# Altium schematic sheet brew_schematic.SchDoc: Monk
size A
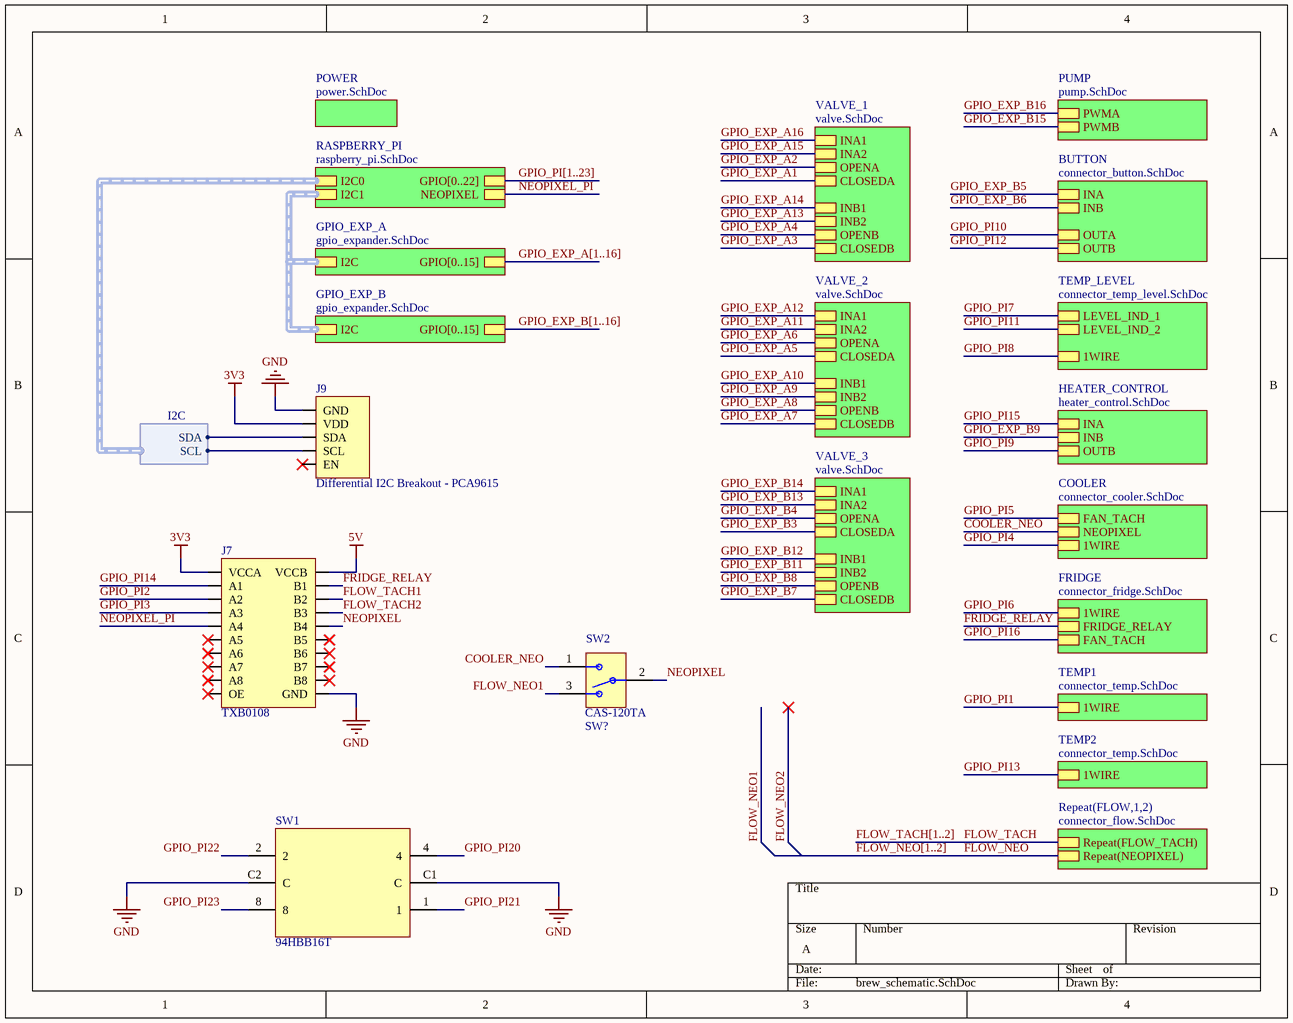
[diagram p0: brew_schematic.SchDoc]

## Parts
J7  TXB0108  [TXB0108]
J9  Differential I2C Breakout - PCA9615  [Differential I2C Breakout - PCA9615]
SW1  MFG P/N: 94HBB16T  [SW_HEX_ROTARY_94HBB16T]  (hidden comment: SWITCH_HEX ROTARY_50V_DIP16)
SW2  MFG P/N: CAS-120TA  Designator: SW?  [SWITCH_CAS-120TA]  (hidden comment: SWITCH_DIP_SPDT_CAS-120TA)

## Sub-sheets
BUTTON = connector_button.SchDoc: INA, INB, OUTB, OUTA
COOLER = connector_cooler.SchDoc: NEOPIXEL, FAN_TACH, 1WIRE
FRIDGE = connector_fridge.SchDoc: FRIDGE_RELAY, 1WIRE, FAN_TACH
GPIO_EXP_A = gpio_expander.SchDoc: GPIO[0..15], I2C (harness I2C)
GPIO_EXP_B = gpio_expander.SchDoc: GPIO[0..15], I2C (harness I2C)
HEATER_CONTROL = heater_control.SchDoc: INA, INB, OUTB
POWER = power.SchDoc: no entries
PUMP = pump.SchDoc: PWMB, PWMA
RASPBERRY_PI = raspberry_pi.SchDoc: I2C1 (harness I2C), I2C0 (harness I2C), GPIO[0..22], NEOPIXEL
Repeat(FLOW,1,2) = connector_flow.SchDoc: Repeat(FLOW_TACH), Repeat(NEOPIXEL)
TEMP1 = connector_temp.SchDoc: 1WIRE
TEMP2 = connector_temp.SchDoc: 1WIRE
TEMP_LEVEL = connector_temp_level.SchDoc: 1WIRE, LEVEL_IND_2, LEVEL_IND_1
VALVE_1 = valve.SchDoc: CLOSEDB, INA2, OPENB, OPENA, CLOSEDA, INB2, INB1, INA1
VALVE_2 = valve.SchDoc: CLOSEDB, INA2, OPENB, OPENA, CLOSEDA, INB2, INB1, INA1
VALVE_3 = valve.SchDoc: CLOSEDB, INA2, OPENB, OPENA, CLOSEDA, INB2, INB1, INA1

## Harnesses
I2C: SDA, SCL

## Nets
3V3: J7.1(VCCA) J9.2(VDD)
5V: J7.20(VCCB)
GND: J7.11(GND) J9.1(GND) SW1.C1(C) SW1.C2(C)
COOLER_NEO: SW2.1 ; sheet COOLER/NEOPIXEL
FLOW_NEO: sheet Repeat(FLOW,1,2)/Repeat(NEOPIXEL)
FLOW_NEO1: SW2.3
FLOW_TACH: sheet Repeat(FLOW,1,2)/Repeat(FLOW_TACH)
FLOW_TACH1: J7.18(B2)
FLOW_TACH2: J7.17(B3)
FRIDGE_RELAY: J7.19(B1) ; sheet FRIDGE/FRIDGE_RELAY
GPIO_EXP_A1: sheet VALVE_1/CLOSEDA
GPIO_EXP_A2: sheet VALVE_1/OPENA
GPIO_EXP_A3: sheet VALVE_1/CLOSEDB
GPIO_EXP_A4: sheet VALVE_1/OPENB
GPIO_EXP_A5: sheet VALVE_2/CLOSEDA
GPIO_EXP_A6: sheet VALVE_2/OPENA
GPIO_EXP_A7: sheet VALVE_2/CLOSEDB
GPIO_EXP_A8: sheet VALVE_2/OPENB
GPIO_EXP_A9: sheet VALVE_2/INB2
GPIO_EXP_A10: sheet VALVE_2/INB1
GPIO_EXP_A11: sheet VALVE_2/INA2
GPIO_EXP_A12: sheet VALVE_2/INA1
GPIO_EXP_A13: sheet VALVE_1/INB2
GPIO_EXP_A14: sheet VALVE_1/INB1
GPIO_EXP_A15: sheet VALVE_1/INA2
GPIO_EXP_A16: sheet VALVE_1/INA1
GPIO_EXP_B3: sheet VALVE_3/CLOSEDA
GPIO_EXP_B4: sheet VALVE_3/OPENA
GPIO_EXP_B5: sheet BUTTON/INA
GPIO_EXP_B6: sheet BUTTON/INB
GPIO_EXP_B7: sheet VALVE_3/CLOSEDB
GPIO_EXP_B8: sheet VALVE_3/OPENB
GPIO_EXP_B9: sheet HEATER_CONTROL/INB
GPIO_EXP_B11: sheet VALVE_3/INB2
GPIO_EXP_B12: sheet VALVE_3/INB1
GPIO_EXP_B13: sheet VALVE_3/INA2
GPIO_EXP_B14: sheet VALVE_3/INA1
GPIO_EXP_B15: sheet PUMP/PWMB
GPIO_EXP_B16: sheet PUMP/PWMA
GPIO_PI1: sheet TEMP1/1WIRE
GPIO_PI2: J7.3(A2)
GPIO_PI3: J7.4(A3)
GPIO_PI4: sheet COOLER/1WIRE
GPIO_PI5: sheet COOLER/FAN_TACH
GPIO_PI6: sheet FRIDGE/1WIRE
GPIO_PI7: sheet TEMP_LEVEL/LEVEL_IND_1
GPIO_PI8: sheet TEMP_LEVEL/1WIRE
GPIO_PI9: sheet HEATER_CONTROL/OUTB
GPIO_PI10: sheet BUTTON/OUTA
GPIO_PI11: sheet TEMP_LEVEL/LEVEL_IND_2
GPIO_PI12: sheet BUTTON/OUTB
GPIO_PI13: sheet TEMP2/1WIRE
GPIO_PI14: J7.2(A1)
GPIO_PI15: sheet HEATER_CONTROL/INA
GPIO_PI16: sheet FRIDGE/FAN_TACH
GPIO_PI20: SW1.4
GPIO_PI21: SW1.1
GPIO_PI22: SW1.2
GPIO_PI23: SW1.8
NEOPIXEL: J7.16(B4) SW2.2
NEOPIXEL_PI: J7.5(A4) ; sheet RASPBERRY_PI/NEOPIXEL
NetJ9_3: J9.3(SDA) ; sheet RASPBERRY_PI/I2C0.SDA
NetJ9_4: J9.4(SCL) ; sheet RASPBERRY_PI/I2C0.SCL

Not connected (* = marked no-connect by the designer): J7 6(A5)* 7(A6)* 8(A7)* 9(A8)* 10(OE)* 12(B8)* 13(B7)* 14(B6)* 15(B5)*; J9 5(EN)*

## Buses and harness runs
bus FLOW_NEO[1..2]
bus FLOW_TACH[1..2]
bus GPIO_EXP_A[1..16] = sheet GPIO_EXP_A/GPIO[0..15]
bus GPIO_EXP_B[1..16] = sheet GPIO_EXP_B/GPIO[0..15]
bus GPIO_PI[1..23] = sheet RASPBERRY_PI/GPIO[0..22]
harness sheet GPIO_EXP_A/I2C = sheet GPIO_EXP_B/I2C = sheet RASPBERRY_PI/I2C1

## Library data of the parts
SW1 = 89: SWITCH ROTARY DIP HEX 100MA 50V; ID: 89; MFG: GRAYHILL; COMMON: 510-00168-00; XPN: XS-10020997; Status: In Development; ComponentLink1Description: Datasheet; ComponentLink1URL: http://www.digikey.com/products/en?keywords=94HBB16T; LOON: 510-00168-00; Gecko: 510-00168-00
SW2 = 38: SLIDE SWITCH SPDT J HOOK 6V; ID: 38; MFG: Copal Electronics Inc; COMMON: 510-00158-00; XPN: XS-10020994; Status: In Development; Category: Switches; RoHS Compliant: Yes; Supplier 1: Digi-Key; Mounting Type: Surface Mount; HelpURL: http://copal-electronics.info/en/0008e/02462.pdf; ComponentLink1Description: Datasheet; ComponentLink1URL: http://copal-electronics.info/en/0008e/02462.pdf; LOON: 510-00158-00; Gecko: 510-00158-00; Supplier Part Number 1: CAS120JCT-ND